# EAGLE design me433 (EAGLE 9.6.2)
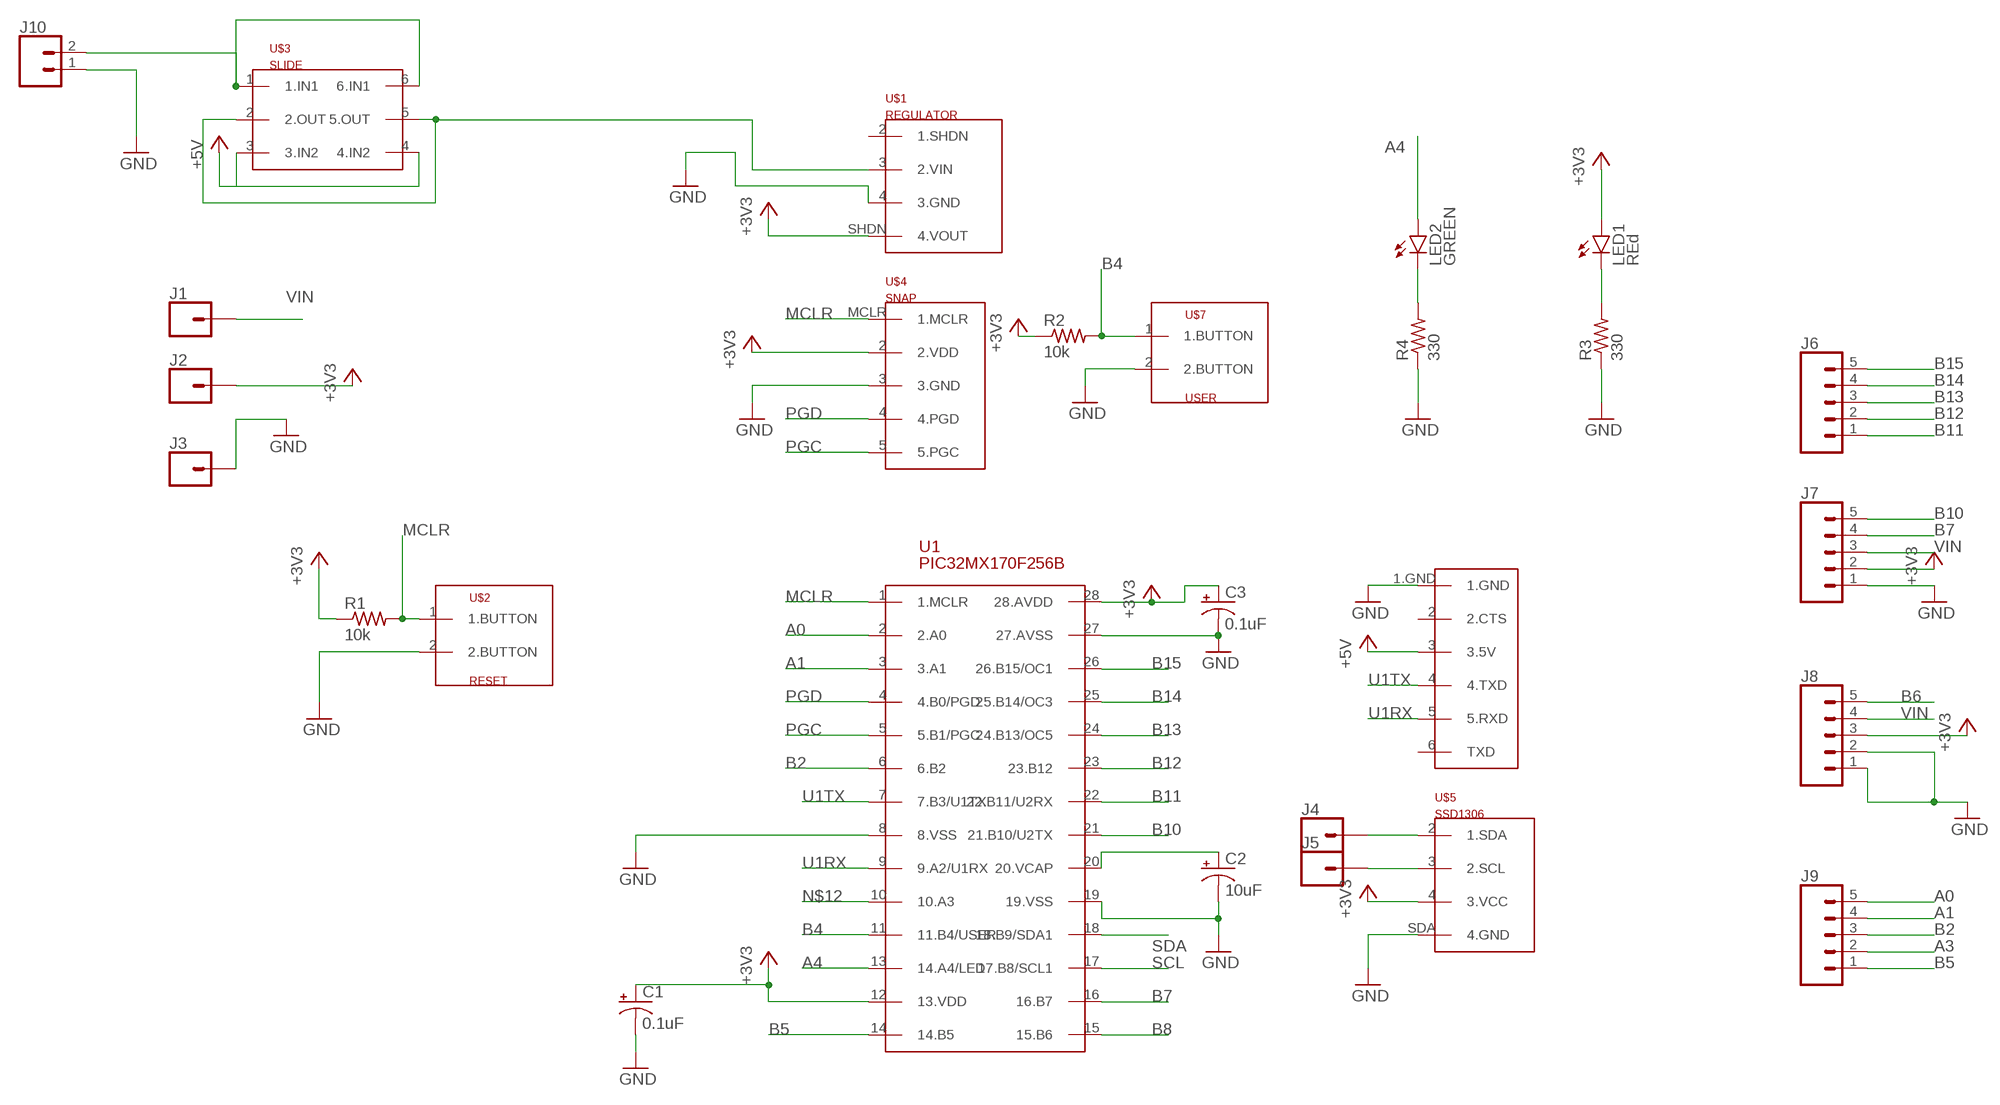
[diagram p0: schematic, sheet 1]

## Parts
C1  0.1uF  CPOL-USB45181B  [B45181B]
C2  10uF  CPOL-USB45181B  [B45181B]
C3  0.1uF  CPOL-USB45181B  [B45181B]
J1  CONN_01PTH_NO_SILK_YES_STOP  [1X01_NO_SILK]
J2  CONN_01PTH_NO_SILK_YES_STOP  [1X01_NO_SILK]
J3  CONN_01PTH_NO_SILK_YES_STOP  [1X01_NO_SILK]
J4  CONN_01PTH_NO_SILK_YES_STOP  [1X01_NO_SILK]
J5  CONN_01PTH_NO_SILK_YES_STOP  [1X01_NO_SILK]
J6  CONN_05NO_SILK  [1X05_NO_SILK]
J7  CONN_05NO_SILK  [1X05_NO_SILK]
J8  CONN_05NO_SILK  [1X05_NO_SILK]
J9  CONN_05NO_SILK  [1X05_NO_SILK]
J10  CONN_02  [1X02]
LED1  REd  LED3MM  [LED3MM]
LED2  GREEN  LED3MM  [LED3MM]
R1  10k  R-US_0204/7  [0204/7]
R2  10k  R-US_0204/7  [0204/7]
R3  330  R-US_0204/7  [0204/7]
R4  330  R-US_0204/7  [0204/7]
U1  PIC32MX170F256B  [DIL28-3]
U$1  REGULATOR  [REGULATOR]
U$2  RESET  [RESET]
U$3  SLIDE  [SLIDE]
U$4  SNAP  [SNAP]
U$5  SSD1306  [SSD1306]
U$6  USBTOUART  [USBTOUART]
U$7  USER  [USER]

## Nets
+3V3: C1.+ C3.+ J2.1 J7.2 J8.3 LED1.A R1.1 R2.1 U1.12(13.VDD) U1.28(28.AVDD) U$1.SHDN(4.VOUT) U$4.2(2.VDD) U$5.4(3.VCC)
+5V: U$6.3(3.5V)
A0: J9.5 U1.2(2.A0)
A1: J9.4 U1.3(3.A1)
A3: J9.2
A4: LED2.A U1.13(14.A4/LED)
B2: J9.3 U1.6(6.B2)
B4: R2.2 U1.11(11.B4/USER) U$7.1(1.BUTTON)
B5: J9.1 U1.14(14.B5)
B6: J8.5
B7: J7.4 U1.16(16.B7)
B8: U1.15(15.B6)
B10: J7.5 U1.21(21.B10/U2TX)
B11: J6.1 U1.22(22.B11/U2RX)
B12: J6.2 U1.23(23.B12)
B13: J6.3 U1.24(24.B13/OC5)
B14: J6.4 U1.25(25.B14/OC3)
B15: J6.5 U1.26(26.B15/OC1)
GND: C1.- C2.- C3.- J3.1 J7.1 J8.1 J8.2 J10.1 R3.1 R4.1 U1.8(8.VSS) U1.19(19.VSS) U1.27(27.AVSS) U$1.4(3.GND) U$2.2(2.BUTTON) U$4.3(3.GND) U$5.SDA(4.GND) U$6.1.GND U$7.2(2.BUTTON)
MCLR: R1.2 U1.1(1.MCLR) U$2.1(1.BUTTON) U$4.MCLR(1.MCLR)
N$1: J10.2 U$3.1(1.IN1) U$3.6(6.IN1)
N$2: LED1.K(C) R3.2
N$3: U$3.3(3.IN2) U$3.4(4.IN2) ; supply symbol labelled +5V
N$4: U$1.3(2.VIN) U$3.2(2.OUT) U$3.5(5.OUT)
N$5: LED2.K(C) R4.2
N$6: J4.1 U$5.2(1.SDA)
N$7: J5.1 U$5.3(2.SCL)
N$8: C2.+ U1.20(20.VCAP)
N$12: U1.10(10.A3)
PGC: U1.5(5.B1/PGC) U$4.5(5.PGC)
PGD: U1.4(4.B0/PGD) U$4.4(4.PGD)
SCL: U1.17(17.B8/SCL1)
SDA: U1.18(18.B9/SDA1)
U1RX: U1.9(9.A2/U1RX) U$6.5(5.RXD)
U1TX: U1.7(7.B3/U1TX) U$6.4(4.TXD)
VIN: J1.1 J7.3 J8.4
Unconnected: U$1.2(1.SHDN) U$6.2(2.CTS) U$6.6(TXD)

## Library data of the parts
C1-C3 = ME433:CPOL-US: POLARIZED CAPACITOR, American symbol; SPICEPREFIX: C
J1-J5 = ME433:CONN_01: Single connection point. Often used as Generic Header-pin footprint for 0.1 inch spaced/style header connections On any of the 0.1 inch spaced packages, you can populate with these: Break Away Headers - Straight <https://www.sparkfun.com/products/116> (PRT-00116) Break Away Male Headers - Right Angle <https://www.sparkfun.com/products/553> (PRT-00553) Female Headers <https://www.sparkfun.com/products/115> (PRT-00115) Break Away Headers - Machine Pin <https://www.sparkfun.com/products/117> (PRT-00117) Break Away Female Headers - Swiss Machine Pin <https://www.sparkfun.com/products/743> (PRT-00743) This device is also useful as a general connection point to wire up your design to another part of your project. Our various solder wires solder well into these plated through hole pads. Hook-Up Wire - Assortment (Stranded, 22 AWG) <https://www.sparkfun.com/products/11375> (PRT-11375) Hook-Up Wire - Assortment (Solid Core, 22 AWG) <https://www.sparkfun.com/products/11367> (PRT-11367) View the entire wire category on our website here <https://www.sparkfun.com/categories/141> Special notes: SMTSO-256-ET is a "flush mount" nut for a 4-40 screw. We mostly use this on specialty testbeds; it is a nice way to connect hardware to your PCB at an adjustable hieght. Also note, the SNAP packages are for using a snappable style connector. We sell a baggie of snaps and they are also used on two LilyPad designs: Snap Assortment - 30 pack (male and female) <https://www.sparkfun.com/products/11347> (DEV-11347) LilyPad Arduino SimpleSnap <https://www.sparkfun.com/products/10941> (DEV-10941) LilyPad SimpleSnap Protoboard <https://www.sparkfun.com/products/10940> (DEV-10940)
J6-J9 = ME433:CONN_05: Multi connection point. Often used as Generic Header-pin footprint for 0.1 inch spaced/style header connections On any of the 0.1 inch spaced packages, you can populate with these: Break Away Headers - Straight <https://www.sparkfun.com/products/116> (PRT-00116) Break Away Male Headers - Right Angle <https://www.sparkfun.com/products/553> (PRT-00553) Female Headers <https://www.sparkfun.com/products/115> (PRT-00115) Break Away Headers - Machine Pin <https://www.sparkfun.com/products/117> (PRT-00117) Break Away Female Headers - Swiss Machine Pin <https://www.sparkfun.com/products/743> (PRT-00743) For SCREWTERMINALS and SPRING TERMINALS visit here: Screw Terimnals on SparkFun.com <https://www.sparkfun.com/search/results?term=Screw+Terminals> (5mm/3.5mm/2.54mm spacing) This device is also useful as a general connection point to wire up your design to another part of your project. Our various solder wires solder well into these plated through hole pads. Hook-Up Wire - Assortment (Stranded, 22 AWG) <https://www.sparkfun.com/products/11375> (PRT-11375) Hook-Up Wire - Assortment (Solid Core, 22 AWG) <https://www.sparkfun.com/products/11367> (PRT-11367) View the entire wire category on our website here <https://www.sparkfun.com/categories/141> Special notes: Molex polarized connector foot print use with SKU : PRT-08231 with associated crimp pins and housings. 1MM SMD Version SKU: PRT-10208
J10 = ME433:CONN_02: Multi connection point. Often used as Generic Header-pin footprint for 0.1 inch spaced/style header connections On any of the 0.1 inch spaced packages, you can populate with these: Break Away Headers - Straight <https://www.sparkfun.com/products/116> (PRT-00116) Break Away Male Headers - Right Angle <https://www.sparkfun.com/products/553> (PRT-00553) Female Headers <https://www.sparkfun.com/products/115> (PRT-00115) Break Away Headers - Machine Pin <https://www.sparkfun.com/products/117> (PRT-00117) Break Away Female Headers - Swiss Machine Pin <https://www.sparkfun.com/products/743> (PRT-00743) For SCREWTERMINALS and SPRING TERMINALS visit here: Screw Terimnals on SparkFun.com <https://www.sparkfun.com/search/results?term=Screw+Terminals> (5mm/3.5mm/2.54mm spacing) This device is also useful as a general connection point to wire up your design to another part of your project. Our various solder wires solder well into these plated through hole pads. Hook-Up Wire - Assortment (Stranded, 22 AWG) <https://www.sparkfun.com/products/11375> (PRT-11375) Hook-Up Wire - Assortment (Solid Core, 22 AWG) <https://www.sparkfun.com/products/11367> (PRT-11367) View the entire wire category on our website here <https://www.sparkfun.com/categories/141> Special notes: Molex polarized connector foot print use with: PRT-08233 with associated crimp pins and housings. 2.54_SCREWTERM for use with PRT-10571. 3.5mm Screw Terminal footprints for PRT-08084 5mm Screw Terminal footprints for use with PRT-08432
LED1 LED2 = ME433:LED: LED OSRAM: - CHIPLED LG R971, LG N971, LY N971, LG Q971, LY Q971, LO R971, LY R971 LH N974, LH R974 LS Q976, LO Q976, LY Q976 LO Q996 - Hyper CHIPLED LW Q18S LB Q993, LB Q99A, LB R99A - SideLED LS A670, LO A670, LY A670, LG A670, LP A670 LB A673, LV A673, LT A673, LW A673 LH A674 LY A675 LS A676, LA A676, LO A676, LY A676, LW A676 LS A679, LY A679, LG A679 - Hyper Micro SIDELED® LS Y876, LA Y876, LO Y876, LY Y876 LT Y87S - SmartLED LW L88C, LW L88S LB L89C, LB L89S, LG L890 LS L89K, LO L89K, LY L89K LS L896, LA L896, LO L896, LY L896 - TOPLED LS T670, LO T670, LY T670, LG T670, LP T670 LSG T670, LSP T670, LSY T670, LOP T670, LYG T670 LG T671, LOG T671, LSG T671 LB T673, LV T673, LT T673, LW T673 LH T674 LS T676, LA T676, LO T676, LY T676, LB T676, LH T676, LSB T676, LW T676 LB T67C, LV T67C, LT T67C, LS T67K, LO T67K, LY T67K, LW E67C LS E67B, LA E67B, LO E67B, LY E67B, LB E67C, LV E67C, LT E67C LW T67C LS T679, LY T679, LG T679 LS T770, LO T770, LY T770, LG T770, LP T770 LB T773, LV T773, LT T773, LW T773 LH T774 LS E675, LA E675, LY E675, LS T675 LS T776, LA T776, LO T776, LY T776, LB T776 LHGB T686 LT T68C, LB T68C - Hyper Mini TOPLED® LB M676 - Mini TOPLED Santana® LG M470 LS M47K, LO M47K, LY M47K Source: http://www.osram.convergy.de LUXEON: - LUMILED® LXK2-PW12-R00, LXK2-PW12-S00, LXK2-PW14-U00, LXK2-PW14-V00 LXK2-PM12-R00, LXK2-PM12-S00, LXK2-PM14-U00 LXK2-PE12-Q00, LXK2-PE12-R00, LXK2-PE12-S00, LXK2-PE14-T00, LXK2-PE14-U00 LXK2-PB12-K00, LXK2-PB12-L00, LXK2-PB12-M00, LXK2-PB14-N00, LXK2-PB14-P00, LXK2-PB14-Q00 LXK2-PR12-L00, LXK2-PR12-M00, LXK2-PR14-Q00, LXK2-PR14-R00 LXK2-PD12-Q00, LXK2-PD12-R00, LXK2-PD12-S00 LXK2-PH12-R00, LXK2-PH12-S00 LXK2-PL12-P00, LXK2-PL12-Q00, LXK2-PL12-R00 Source: www.luxeon.com KINGBRIGHT: KA-3528ASYC Source: www.kingbright.com
R1-R4 = ME433:R-US_: RESISTOR, American symbol; SPICEPREFIX: R
U1 = ME433:PIC32MX170F256B
U$1 = ME433:REGULATOR
U$2 = ME433:RESET
U$3 = ME433:SLIDE
U$4 = ME433:SNAP
U$5 = ME433:SSD1306
U$6 = ME433:USBTOUART
U$7 = ME433:USER

## Board
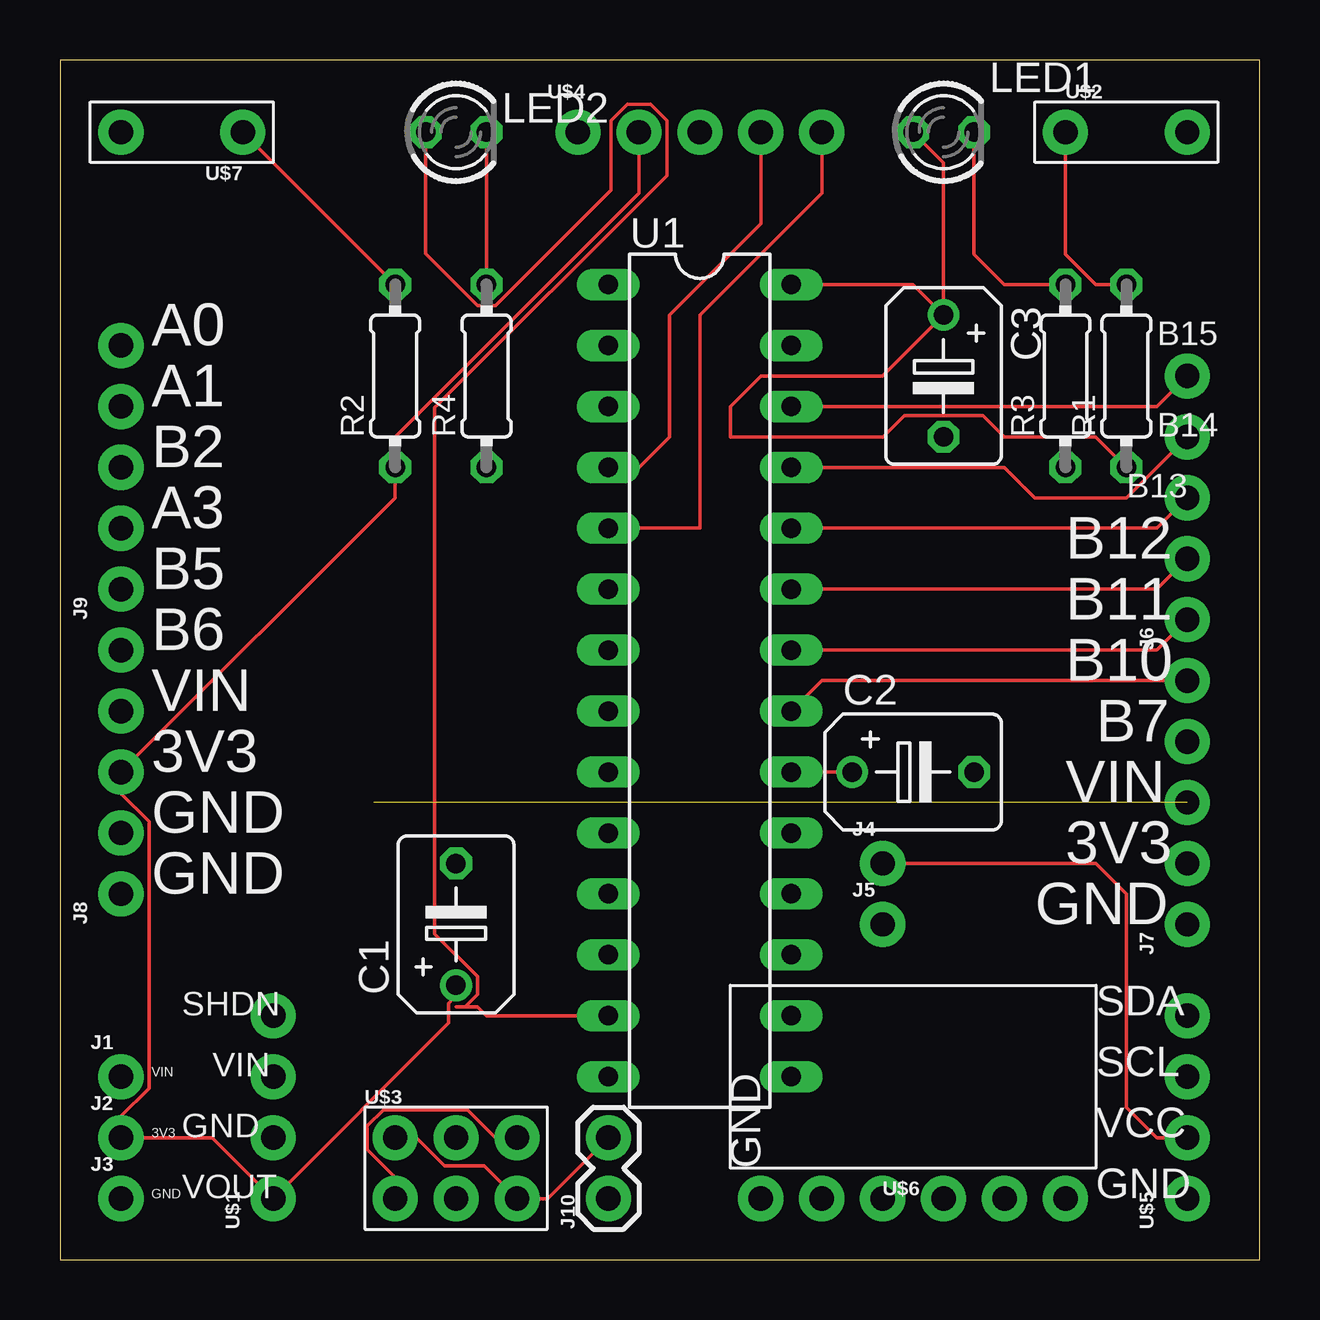
[diagram p1: board, top side]
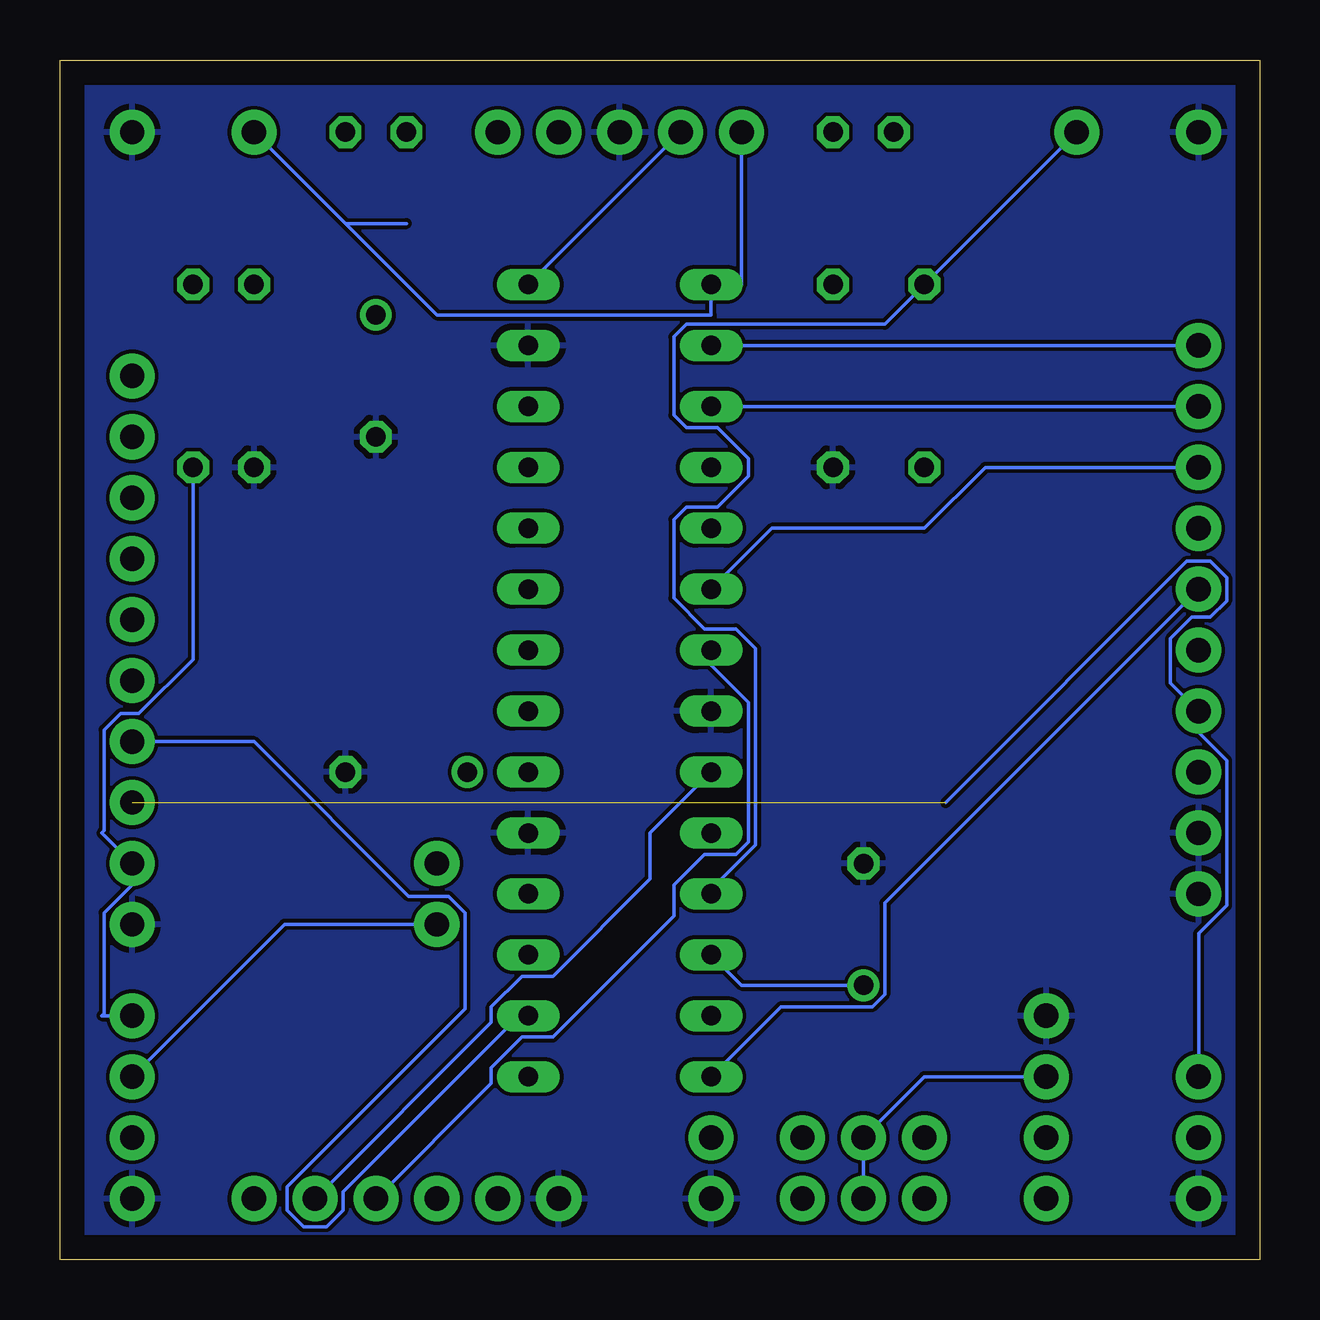
[diagram p2: board, bottom side, seen from below]

Size 50 x 50 mm. Coordinates in mm from the lower left corner, seen from the top.
Outline: 0,0 50,0 50,50 0,50 0,0
Copper layers (1*16): Top 0.035mm / dielectric 1.5mm / Bottom 0.035mm
Design rules "default": minimum track width 6mil, minimum drill 0.35mm, track to track 6mil, track to pad 6mil, pad to pad 6mil, via to via 6mil, smd to smd 6mil, copper to edge 40mil, drill to drill 6mil, minimum pad ring 10mil, minimum via ring 8mil, stop-mask expansion 4mil, vias tented up to drill 0mil, thermal gap 10mil

### Footprints (pad centres in the part's own frame; a part is rotated, then mirrored left to right if it is on the bottom)
B45181B = drill 0.813: + -2.54,0 | drill 0.813 octagon: - 2.54,0
1X01_NO_SILK = drill 1.016 pad 1.88: 1 0,0
1X05_NO_SILK = drill 1.016 pad 1.88: 1 0,0; 2 2.54,0; 3 5.08,0; 4 7.62,0; 5 10.16,0
1X02 = drill 1.016 pad 1.88: 1 0,0; 2 2.54,0
LED3MM = drill 0.813 octagon: A -1.27,0; K 1.27,0
0204/7 = drill 0.813 octagon: 1 -3.81,0; 2 3.81,0
DIL28-3 = drill 0.813 long: 1 -16.51,-3.81; 2 -13.97,-3.81; 3 -11.43,-3.81; 4 -8.89,-3.81; 5 -6.35,-3.81; 6 -3.81,-3.81; 7 -1.27,-3.81; 8 1.27,-3.81; 9 3.81,-3.81; 10 6.35,-3.81; 11 8.89,-3.81; 12 11.43,-3.81; 13 13.97,-3.81; 14 16.51,-3.81; 15 16.51,3.81; 16 13.97,3.81; 17 11.43,3.81; 18 8.89,3.81; 19 6.35,3.81; 20 3.81,3.81; 21 1.27,3.81; 22 -1.27,3.81; 23 -3.81,3.81; 24 -6.35,3.81; 25 -8.89,3.81; 26 -11.43,3.81; 27 -13.97,3.81; 28 -16.51,3.81
REGULATOR = drill 1.016 pad 1.88: 2 -1.27,0; 3 1.27,0; 4 3.81,0; SHDN -3.81,0
RESET = drill 1.016 pad 1.88: 1 -2.54,0; 2 2.54,0
SLIDE = drill 1.016 pad 1.88: 1 -2.54,1.27; 2 0,1.27; 3 2.54,1.27; 4 -2.54,-1.27; 5 0,-1.27; 6 2.54,-1.27
SNAP = drill 1.016 pad 1.88: 2 -2.54,0; 3 0,0; 4 2.54,0; 5 5.08,0; MCLR -5.08,0
SSD1306 = drill 1.016 pad 1.88: 2 -1.27,0; 3 1.27,0; 4 3.81,0; SDA -3.81,0
USBTOUART = drill 1.016 pad 1.88: 1.GND -6.35,0; 2 -3.81,0; 3 -1.27,0; 4 1.27,0; 5 3.81,0; 6 6.35,0
USER = drill 1.016 pad 1.88: 1 -2.54,0; 2 2.54,0

### Placement (x,y rotation side)
C1  16.51,13.97 90 top
C2  35.56,20.32 0 top
C3  36.83,36.83 270 top
J1  2.54,7.62 0 top
J2  2.54,5.08 0 top
J3  2.54,2.54 0 top
J4  34.29,16.51 0 top
J5  34.29,13.97 0 top
J6  46.99,26.67 90 top
J7  46.99,13.97 90 top
J8  2.54,15.24 90 top
J9  2.54,27.94 90 top
J10  22.86,2.54 90 top
LED1  36.83,46.99 0 top
LED2  16.51,46.99 0 top
R1  44.45,36.83 90 top
R2  13.97,36.83 90 top
R3  41.91,36.83 90 top
R4  17.78,36.83 90 top
U1  26.67,24.13 270 top
U$1  8.89,6.35 90 top
U$2  44.45,46.99 0 top
U$3  16.51,3.81 0 top
U$4  26.67,46.99 0 top
U$5  46.99,6.35 90 top
U$6  35.56,2.54 0 top
U$7  5.08,46.99 180 top

### Tracks (layer width: path | path; a pad name or v marks a point on that pad's centre or on a via)
+3V3
  Top 0.152: U1.28 35.56,40.64 C3.+ | LED1.A 36.83,45.72 C3.+ | C3.+ 34.29,36.83 29.21,36.83 27.94,35.56 27.94,34.29 34.3,34.29 35.19,35.18 38.47,35.18 39.36,34.29 43.18,34.29 R1.1 | C1.+ 16.51,10.97 16.2,10.67 16.2,9.86 U$1.SHDN 6.35,5.08 J2.1 2.54,5.97 3.71,7.14 3.71,18.26 2.54,19.43 J8.3 13.97,31.75 R2.1 13.97,34.29 24.13,44.45 U$4.2
  Bottom 0.152: U1.12 21.59,11.43 C1.+ | U$4.2 U1.28 | R1.1 44.45,25.02 46.71,22.76 47.47,22.76 48.16,22.07 48.16,17.88 48.26,17.78 J7.2 46.99,15.62 48.16,14.45 48.16,10.26 48.26,10.16 U$5.4
A0
  Bottom 0.152: J9.5 U1.2
A1
  Bottom 0.152: J9.4 U1.3
A4
  Top 0.152: U1.13 17.78,10.16 17.4,10.54 16.88,10.54 | 16.88,10.54 17.4,11.06 17.4,11.8 15.62,13.58 15.62,35.51 25.3,45.19 25.3,47.47 24.61,48.16 23.65,48.16 22.96,47.47 22.96,44.56 18.15,39.75 17.41,39.75 15.24,41.92 LED2.A | 16.88,10.54 16.51,10.54
B2
  Bottom 0.152: J9.3 11.43,33.02 13.97,30.48 20.32,30.48 U1.6
B4
  Top 0.152: U$7.1 R2.2
  Bottom 0.152: U1.11 22.86,15.43 21.01,17.29 21.01,25.46 21.83,26.29 23.13,26.29 24.41,27.57 24.41,30.85 23.89,31.37 22.59,31.37 21.31,32.65 21.31,33.39 22.59,34.67 23.89,34.67 24.41,35.19 24.41,38.47 23.89,38.99 15.62,38.99 U$7.1
B5
  Bottom 0.152: J9.1 15.62,14.86 15.62,11.06 16.14,10.54 19.94,10.54 U1.14
B7
  Bottom 0.152: J7.4 41.91,21.59 35.46,15.14 33.81,15.14 33.12,14.45 33.12,10.44 40.54,3.02 40.54,2.06 39.85,1.37 38.89,1.37 38.2,2.06 38.2,2.82 30.86,10.16 U1.16
B10
  Top 0.152: U1.21 31.75,24.13 J7.5
B11
  Top 0.152: U1.22 45.72,25.4 J6.1
B12
  Top 0.152: U1.23 45.72,27.94 J6.2
B13
  Top 0.152: U1.24 45.72,30.48 J6.3
B14
  Top 0.152: U1.25 39.37,33.02 40.64,31.75 44.45,31.75 J6.4
B15
  Top 0.152: U1.26 45.72,35.56 J6.5
GND
  pour Bottom: 0,49.53 0,-1.27 1.27,0 49.53,0 50.8,1.27 50.8,49.53
MCLR
  Top 0.152: U$2.1 41.91,41.91 43.18,40.64 R1.2
  Bottom 0.152: 35.56,43.18 38.1,43.18 U$2.1 34.29,39.37 22.86,39.37 U1.1 21.59,40.64 U$4.MCLR
N$1
  Top 0.152: U$3.1 14.86,5.08 16.03,3.91 17.68,3.91 U$3.6 20.32,2.54 J10.2
N$2
  Top 0.152: LED1.K 38.1,41.91 39.37,40.64 R3.2
N$3
  Top 0.152: U$3.3 18.16,5.08 16.99,6.25 13.49,6.25 12.8,5.56 12.8,4.6 13.97,3.43 U$3.4
N$4
  Bottom 0.152: U$1.3 13.97,7.62 U$3.2 U$3.5
N$5
  Top 0.152: LED2.K R4.2
N$6
  Top 0.152: J4.1 43.18,16.51 44.45,15.24 44.45,6.35 45.72,5.08 U$5.2
N$7
  Bottom 0.152: J5.1 40.64,13.97 U$5.3
N$8
  Top 0.152: U1.20 C2.+
PGC
  Top 0.152: U$4.5 31.75,44.45 26.67,39.37 26.67,30.48 U1.5
PGD
  Top 0.152: U$4.4 29.21,43.18 25.4,39.37 25.4,34.29 24.13,33.02 U1.4
U1RX
  Bottom 0.152: U$6.5 32.03,9.88 32.03,10.53 30.75,11.81 29.45,11.81 25.4,15.86 25.4,17.78 U1.9
U1TX
  Bottom 0.152: U$6.4 32.03,7.34 32.03,7.99 30.75,9.27 29.45,9.27 24.41,14.31 24.41,15.61 23.13,16.89 21.83,16.89 21.31,17.41 21.31,23.23 22.86,24.78 U1.7
VIN  (1 unrouted)
  Bottom 0.152: J1.1 2.54,13.59 1.37,14.76 1.37,20.8 2.54,21.97 J8.4 3.71,24.03 3.71,25.88 2.82,26.77 2.06,26.77 1.37,27.46 1.37,28.42 2.06,29.11 3.02,29.11 13.08,19.05

### Text on the board
tPlace: A0 | B15 | A1 | B14 | B2 | B13 | A3 | B12 | B5 | B11 | B6 | B10 | VIN | B7 | 3V3 | VIN | GND | 3V3 | GND | GND | SHDN | SDA | VIN | VIN | SCL | 3V3 | GND | VCC | GND | VOUT | GND